# Altium schematic sheet harness_detect.SchDoc
size A
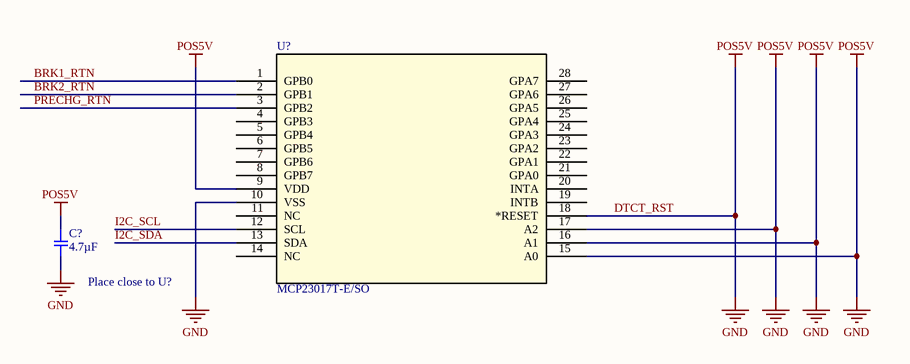
[diagram p0: harness_detect.SchDoc]

## Parts
C?  4.7µF  [SMD-0805C]
U?  MCP23017T-E/SO  [SOIC28-W_MC-M]

## Nets
DTCT_RST: C?.1 C?.2 U?.9(VDD) U?.10(VSS) U?.15(A0) U?.16(A1) U?.17(A2) U?.18(*RESET)  [also labelled GND, POS5V]
BRK1_RTN: U?.1(GPB0)
BRK2_RTN: U?.2(GPB1)
I2C_SCL: U?.12(SCL)
I2C_SDA: U?.13(SDA)
PRECHG_RTN: U?.3(GPB2)

Not connected (* = marked no-connect by the designer): U? 4(GPB3) 5(GPB4) 6(GPB5) 7(GPB6) 8(GPB7) 11(NC) 14(NC) 19(INTB) 20(INTA) 21(GPA0) 22(GPA1) 23(GPA2) 24(GPA3) 25(GPA4) 26(GPA5) 27(GPA6) 28(GPA7)

## Notes on the sheet
- (near C?) Place close to U?

## Library data of the parts
C? = GRM21BR60J475KA11L: CAP CER 4.7UF 6.3V X5R 0805; Manufacturer: Murata Electronics North America; Factory Stock: 0; Unit Price (USD): 0.28; Minimum Quantity: 1; Tolerance: ±10%; Datasheets: http://www.murata.com/~/media/webrenewal/support/library/catalog/products/capacitor/mlcc/c02e.pdf; Image: //media.digikey.com/Renders/Murata%20Renders/0805%20(2012%20Metric)%20.85mm.jpg; Digi-Key Part Number: 490-9749-1-ND; Part Number: GRM21BR60J475KA11L; Quantity Available: 2821; @ qty: 0; Packaging: Cut Tape (CT); Series: GRM; Part Status: Active; Value: 4.7µF; Voltage: 6.3V; Temperature Coefficient: X5R; Operating Temperature: -55°C ~ 85°C; Features: -; Ratings: -; Applications: General Purpose; Mounting Type: Surface Mount, MLCC; Package / Case: 0805 (2012 Metric); Size / Dimension: 0.079" L x 0.049" W (2.00mm x 1.25mm); Height - Seated (Max): -; Thickness (Max): 0.055" (1.40mm); Lead Spacing: -; Lead Style: -
U? = MCP23017T-E/SO: IC I/O EXPANDER I2C 16B 28SOIC; Manufacturer: Microchip; Manufacturer P/N: MCP23017T-E/SO; Digikey P/N: MCP23017T-E/SOCT-ND; Digikey Link: https://www.digikey.com/product-detail/en/microchip-technology/MCP23017T-E-SO/MCP23017T-E-SOCT-ND/5358289